# Altium schematic sheet motor1.SchDoc
size A4; SheetNumber: 3; SheetTotal: 4
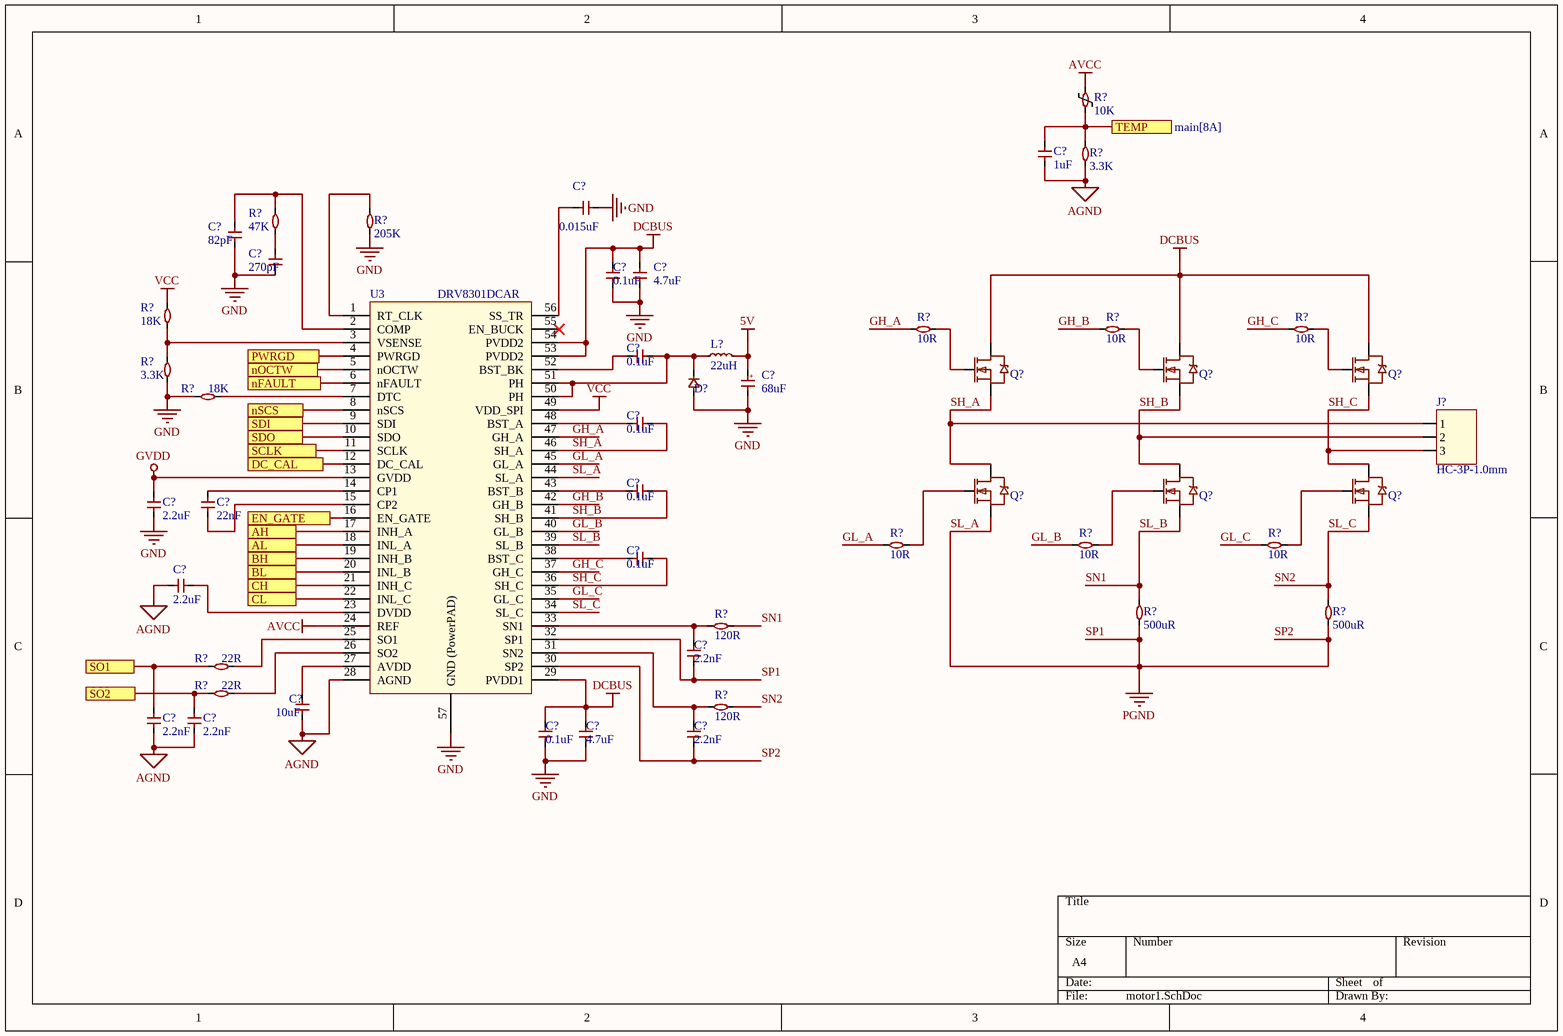
[diagram p0: motor1.SchDoc]

## Parts
(Parts that share a designator on the sheet are numbered #1, #2 ... from top to bottom, then left to right.)
C?#1  1uF  [C0402]
C?#2  0.015uF  [C0402]
C?#3  82pF  [C0402]
C?#4  270pF  [C0402]
C?#5  0.1uF  [C0402]
C?#6  4.7uF  [C0402]
C?#7  0.1uF  [C0402]
C?#8  68uF  [C0402]
C?#9  0.1uF  [C0402]
C?#10  0.1uF  [C0402]
C?#11  2.2uF  [C0402]
C?#12  22nF  [C0402]
C?#13  0.1uF  [C0402]
C?#14  2.2uF  [C0402]
C?#15  2.2nF  [C0402]
C?#16  10uF  [C0402]
C?#17  2.2nF  [C0402]
C?#18  2.2nF  [C0402]
C?#19  0.1uF  [C0402]
C?#20  4.7uF  [C0402]
C?#21  2.2nF  [C0402]
D?  DIO  [C0402]  (value not drawn)
J?  HC-3P-1.0mm
L?  22uH
Q?#1  AO3400A  [SOT-23-3_L2.9-W1.3-P1.90-LS2.4-BR]  (value not drawn)
Q?#2  AO3400A  [SOT-23-3_L2.9-W1.3-P1.90-LS2.4-BR]  (value not drawn)
Q?#3  AO3400A  [SOT-23-3_L2.9-W1.3-P1.90-LS2.4-BR]  (value not drawn)
Q?#4  AO3400A  [SOT-23-3_L2.9-W1.3-P1.90-LS2.4-BR]  (value not drawn)
Q?#5  AO3400A  [SOT-23-3_L2.9-W1.3-P1.90-LS2.4-BR]  (value not drawn)
Q?#6  AO3400A  [SOT-23-3_L2.9-W1.3-P1.90-LS2.4-BR]  (value not drawn)
R?#1  10K  [R0402_1]
R?#2  3.3K  [R0402_1]
R?#3  47K  [R0402_1]
R?#4  205K  [R0402_1]
R?#5  18K  [R0402_1]
R?#6  10R  [R0402_1]
R?#7  10R  [R0402_1]
R?#8  10R  [R0402_1]
R?#9  3.3K  [R0402_1]
R?#10  18K  [R0402_1]
R?#11  10R  [R0402_1]
R?#12  10R  [R0402_1]
R?#13  10R  [R0402_1]
R?#14  500uR  [R0402_1]
R?#15  500uR  [R0402_1]
R?#16  120R  [R0402_1]
R?#17  22R  [R0402_1]
R?#18  22R  [R0402_1]
R?#19  120R  [R0402_1]
U3  DRV8301DCAR

## Ports
AH (see main[7A]), AL (see main[7A]), BH (see main[7A]), BL (see main[7A]), CH (see main[7A]), CL (see main[7A]), DC_CAL (see main[7A]), EN_GATE (see main[7A]), nFAULT (see main[8A]), nOCTW (see main[8A]), nSCS (see main[7A]), PWRGD (see main[8A]), SCLK (see main[7A]), SDI (see main[7A]), SDO (see main[7A]), SO1 (see main[8A]), SO2 (see main[8A]), TEMP (see main[8A])

## Nets
5V: C?#8.1 L?.2
AGND: C?#1.2 C?#14.1 C?#16.2 C?#17.2 C?#18.2 R?#2.1 U3.28(AGND)
AVCC: R?#1.2 U3.24(REF)
DCBUS: C?#5.1 C?#6.1 C?#19.1 C?#20.1 Q?#1.3(D) Q?#2.3(D) Q?#3.3(D) U3.29(PVDD1) U3.53(PVDD2) U3.54(PVDD2)
GND: C?#2.2 C?#3.1 C?#4.1 C?#5.2 C?#6.2 C?#8.2 C?#11.1 C?#19.2 C?#20.2 D?.2 R?#4.2 R?#9.1 R?#10.1 U3.57(GND_(PowerPAD))
GVDD: C?#11.2 U3.13(GVDD)
SL_A: C?#15.2 C?#21.2 Q?#4.2(S) R?#14.2 R?#15.2 U3.30(SP2) U3.32(SP1) U3.44(SL_A)  [also labelled PGND, SP1, SP2]
VCC: R?#5.2 U3.49(VDD_SPI)
AH: U3.17(INH_A) ; port AH
AL: U3.18(INL_A) ; port AL
BH: U3.19(INH_B) ; port BH
BL: U3.20(INL_B) ; port BL
CH: U3.21(INH_C) ; port CH
CL: U3.22(INL_C) ; port CL
DC_CAL: U3.12(DC_CAL) ; port DC_CAL
EN_GATE: U3.16(EN_GATE) ; port EN_GATE
GH_A: R?#6.2 U3.47(GH_A)
GH_B: R?#7.2 U3.42(GH_B)
GH_C: R?#8.2 U3.37(GH_C)
GL_A: R?#11.2 U3.45(GL_A)
GL_B: R?#12.2 U3.40(GL_B)
GL_C: R?#13.2 U3.35(GL_C)
nFAULT: U3.6(nFAULT) ; port nFAULT
nOCTW: U3.5(nOCTW) ; port nOCTW
nSCS: U3.8(nSCS) ; port nSCS
PWRGD: U3.4(PWRGD) ; port PWRGD
SCLK: U3.11(SCLK) ; port SCLK
SDI: U3.9(SDI) ; port SDI
SDO: U3.10(SDO) ; port SDO
SH_A: C?#9.2 J?.1 Q?#1.2(S) Q?#4.3(D) U3.46(SH_A)
SH_B: C?#10.2 J?.2 Q?#2.2(S) Q?#5.3(D) U3.41(SH_B)
SH_C: C?#13.2 J?.3 Q?#3.2(S) Q?#6.3(D) U3.36(SH_C)
SL_B: Q?#5.2(S) R?#14.1 R?#16.2 U3.39(SL_B)  [also labelled SN1]
SL_C: Q?#6.2(S) R?#15.1 R?#19.2 U3.34(SL_C)  [also labelled SN2]
SO1: C?#17.1 R?#17.1 ; port SO1
SO2: C?#18.1 R?#18.1 ; port SO2
TEMP: C?#1.1 R?#1.1 R?#2.2 ; port TEMP
NetC?#2_1: C?#2.1 U3.56(SS_TR)
NetC?#3_2: C?#3.2 R?#3.1 U3.2(COMP)
NetC?#4_2: C?#4.2 R?#3.2
NetC?#7_1: C?#7.1 U3.52(BST_BK)
NetC?#7_2: C?#7.2 D?.1 L?.1 U3.50(PH) U3.51(PH)
NetC?#9_1: C?#9.1 U3.48(BST_A)
NetC?#10_1: C?#10.1 U3.43(BST_B)
NetC?#12_1: C?#12.1 U3.15(CP2)
NetC?#12_2: C?#12.2 U3.14(CP1)
NetC?#13_1: C?#13.1 U3.38(BST_C)
NetC?#14_2: C?#14.2 U3.23(DVDD)
NetC?#15_1: C?#15.1 R?#16.1 U3.33(SN1)
NetC?#16_1: C?#16.1 U3.27(AVDD)
NetC?#21_1: C?#21.1 R?#19.1 U3.31(SN2)
NetQ?#1_1: Q?#1.1(G) R?#6.1
NetQ?#2_1: Q?#2.1(G) R?#7.1
NetQ?#3_1: Q?#3.1(G) R?#8.1
NetQ?#4_1: Q?#4.1(G) R?#11.1
NetQ?#5_1: Q?#5.1(G) R?#12.1
NetQ?#6_1: Q?#6.1(G) R?#13.1
NetR?#4_1: R?#4.1 U3.1(RT_CLK)
NetR?#5_1: R?#5.1 R?#9.2 U3.3(VSENSE)
NetR?#10_2: R?#10.2 U3.7(DTC)
NetR?#17_2: R?#17.2 U3.25(SO1)
NetR?#18_2: R?#18.2 U3.26(SO2)

Not connected (* = marked no-connect by the designer): U3 55(EN_BUCK)*

## Notes on the sheet
- (in symbol CAP+) +

## Library data of the parts
C?#1-C?#7 C?#9-C?#21 = CAP: 贴片电容; Manufacturer: SAMSUNG(三星); Manufacturer Part: CL05A105KP5NNND; Add into BOM: yes; Tolerance: ±10%; Voltage Rated: 10V; Temperature Coefficient: X5R; Symbol: CAP-0402; Device: cap-0402; LCSC Part Name: 1uF ±10% 10V; Supplier Part: C307414; Supplier Footprint: 0402; JLCPCB Part Class: Extended Part; Datasheet: https://atta.szlcsc.com/upload/public/pdf/source/20181009/C307414_0A02B57115E94FED95F0CB1E32115BFC.pdf; Supplier: LCSC; Convert to PCB: yes
C?#8 = CAP+: 贴片型铝电解电容，50V; Manufacturer: SAMSUNG(三星); Manufacturer Part: CL05A105KP5NNND; Add into BOM: yes; Tolerance: ±10%; Voltage Rated: 10V; Temperature Coefficient: X5R; Symbol: CAP-0402; Device: cap-0402; LCSC Part Name: 1uF ±10% 10V; Supplier Part: C307414; Supplier Footprint: 0402; JLCPCB Part Class: Extended Part; Datasheet: https://atta.szlcsc.com/upload/public/pdf/source/20181009/C307414_0A02B57115E94FED95F0CB1E32115BFC.pdf; Supplier: LCSC; Convert to PCB: yes
D? = DIO: 通用二极管; Manufacturer: SAMSUNG(三星); Manufacturer Part: CL05A105KP5NNND; Add into BOM: yes; Tolerance: ±10%; Voltage Rated: 10V; Temperature Coefficient: X5R; Symbol: CAP-0402; Device: cap-0402; LCSC Part Name: 1uF ±10% 10V; Supplier Part: C307414; Supplier Footprint: 0402; JLCPCB Part Class: Extended Part; Datasheet: https://atta.szlcsc.com/upload/public/pdf/source/20181009/C307414_0A02B57115E94FED95F0CB1E32115BFC.pdf; Supplier: LCSC; Convert to PCB: yes
J? = HC-3P-1.0mm: 线对板连接器
L? = IND: 贴片电感
Q?#1-Q?#6 = NMOS: N沟道功率mos管; Manufacturer: BORN(伯恩半导体); Name: AO3401A; Symbol: AO3401A_C306862; Add into BOM: yes; Type: P沟道; Drain Source Voltage (Vdss): 30V; Continuous Drain Current (Id): 4.2A; Power Dissipation (Pd): 1.4W; Drain Source On Resistance (RDS(on)@Vgs,Id): 50mΩ@10V,4.1A; Gate Threshold Voltage (Vgs(th)@Id): 2V@250uA; Device: AO3401A_C306862; LCSC Part Name: P沟道 30V 4.2A; Supplier Part: C306862; Manufacturer Part: AO3401A; Supplier Footprint: SOT-23; JLCPCB Part Class: 扩展库; Datasheet: https://atta.szlcsc.com/upload/public/pdf/source/20190514/C306862_F7EF2FFF49BA48EA0D342955B5285B33.pdf; Supplier: LCSC; Convert to PCB: yes
R?#1 = NTC: 热敏电阻; Manufacturer: UNI-ROYAL(厚声); Manufacturer Part: 0402WGF1001TCE; Add into BOM: yes; Tolerance: ±1%; Power(Watts): 1/16W; Temperature Coefficient: ±100ppm/; Overload Voltage (Max): 50V; Symbol: RES-0402; Device: res-0402; LCSC Part Name: 1k ±1%; Supplier Part: C11702; Supplier Footprint: 0402; Datasheet: https://atta.szlcsc.com/upload/public/pdf/source/20200306/C422600_1E6D84923E4A46A82E41ADD87F860B5C.pdf; Supplier: LCSC; Convert to PCB: yes; Type: 厚膜电阻; Operating Temperature Range: -55~+155; JLCPCB Part Class: 基础库
R?#2-R?#19 = RES: 贴片电阻; Manufacturer: UNI-ROYAL(厚声); Manufacturer Part: 0402WGF1001TCE; Add into BOM: yes; Tolerance: ±1%; Power(Watts): 1/16W; Temperature Coefficient: ±100ppm/; Overload Voltage (Max): 50V; Symbol: RES-0402; Device: res-0402; LCSC Part Name: 1k ±1%; Supplier Part: C11702; Supplier Footprint: 0402; Datasheet: https://atta.szlcsc.com/upload/public/pdf/source/20200306/C422600_1E6D84923E4A46A82E41ADD87F860B5C.pdf; Supplier: LCSC; Convert to PCB: yes; Type: 厚膜电阻; Operating Temperature Range: -55~+155; JLCPCB Part Class: 基础库
U3 = DRV8301DCAR: 三相电机/栅极驱动IC